# Altium schematic sheet Sheet1.SchDoc
size A4
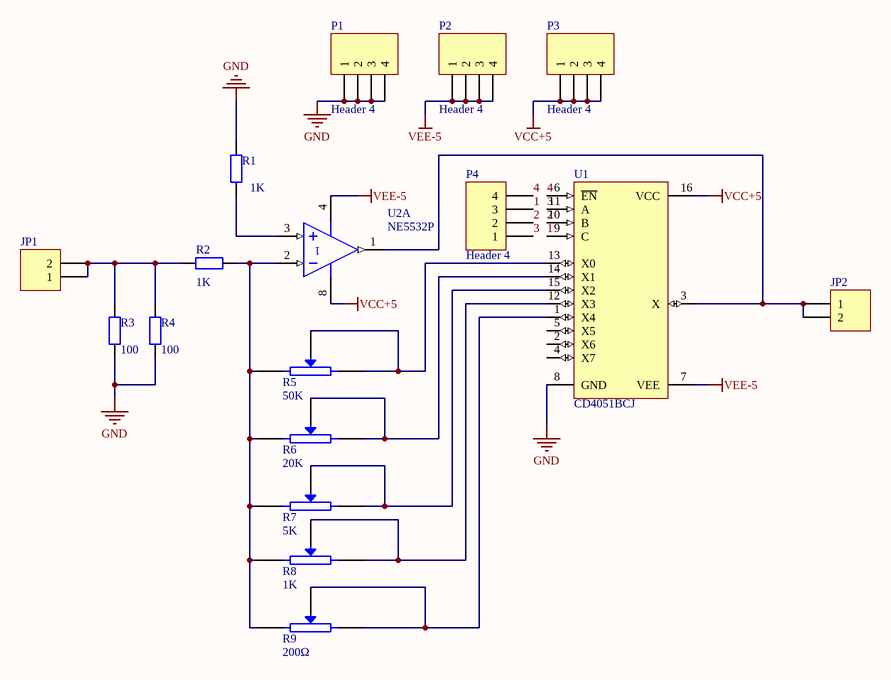
[diagram p0: Sheet1.SchDoc]

## Parts
JP1  Header 2  [HDR1X2]  (value not drawn)
JP2  Header 2  [HDR1X2]  (value not drawn)
P1  Header 4  [HDR1X4]
P2  Header 4  [HDR1X4]
P3  Header 4  [HDR1X4]
P4  Header 4  [HDR1X4]
R1  value 1K  [0805]  (hidden comment: Res2)
R2  value 1K  [0805]  (hidden comment: Res2)
R3  value 100  [0805]  (hidden comment: Res2)
R4  value 100  [0805]  (hidden comment: Res2)
R5  50K  [VR5]
R6  20K  [VR5]
R7  5K  [VR5]
R8  1K  [VR5]
R9  200Ω  [VR5]
U1  CD4051BCJ  [J16A]
U2  NE5532P  [P008]  (part A of 2)

## Nets
GND: P1.1 P1.2 P1.3 P1.4 R1.2 R3.1 R4.1 U1.8(GND)
VCC+5: P3.1 P3.2 P3.3 P3.4 U1.16(VCC) U2.8(V+)
VEE-5: P2.1 P2.2 P2.3 P2.4 U1.7(VEE) U2.4(V-)
1: P4.3 U1.9(C)
2: P4.2 U1.10(B)
3: P4.1 U1.11(A)
4: P4.4 U1.6(~{EN})
NetJP1_1: JP1.1 JP1.2 R2.1 R3.2 R4.2
NetJP2_1: JP2.1 JP2.2 U1.3(X) U2.1(OUT)
NetR1_1: R1.1 U2.3(IN+)
NetR2_2: R2.2 R5.1 R6.1 R7.1 R8.1 R9.1 U2.2(IN-)
NetR5_2: R5.2 R5.3(W) U1.13(X0)
NetR6_2: R6.2 R6.3(W) U1.14(X1)
NetR7_2: R7.2 R7.3(W) U1.15(X2)
NetR8_2: R8.2 R8.3(W) U1.12(X3)
NetR9_2: R9.2 R9.3(W) U1.1(X4)

Not connected (* = marked no-connect by the designer): U1 2(X6) 4(X7) 5(X5)

## Library data of the parts
JP1 JP2 = Header 2: Header, 2-Pin; Revision: 17-Jul-2002: Re-released for DXP Platform.; Publisher: Altium Limited
P1-P4 = Header 4: Header, 4-Pin; LatestRevisionDate: 17-Jul-2002; LatestRevisionNote: Re-released for DXP Platform.; Publisher: Altium Limited
R1-R4 = Res2: Resistor; Published: 8-Jun-2000; LatestRevisionDate: 17-Jul-2002; LatestRevisionNote: Re-released for DXP Platform.; PackageReference: AXIAL-0.4; Publisher: Altium Limited
R5-R9 = POT2: Potentiometer
U1 = CD4051BCJ: 8-Channel Analog Multiplexer/Demultiplexer; Published: 15-Apr-2002; LatestRevisionDate: 06-Jun-2005; LatestRevisionNote: Stylized 3D Model Added.; DatasheetVersion: Oct-1989; PackageVersion: 2000; PackageReference: J16A; Publisher: Altium Limited; PackageDescription: DIP; 16 Leads; Row Spacing 7.62 mm; Pitch 2.54 mm; ComponentLink1Description: Manufacturer Link; ComponentLink1URL: http://www.national.com/; ComponentLink2Description: Datasheet; ComponentLink2URL: http://www.national.com/ds.cgi/CD/CD4051BC.pdf; ComponentLink3Description: URL Link1; ComponentLink3URL: http://www.national.com/pf/CD/CD4051BC.html
U2 = NE5532P: Dual Low-Noise Operational Amplifier; Published: 15-Apr-2002; LatestRevisionDate: 04-Mar-2005; LatestRevisionNote: Stylized 3D Model Added.; DatasheetVersion: May-1988; PackageVersion: Jun-1999; PackageReference: P008; Publisher: Altium Limited; PackageDescription: DIP; 8 Leads; Row Spacing 7.62 mm; Pitch 2.54 mm; Code_JEDEC: MO-001-AN; ComponentLink1Description: Manufacturer Link; ComponentLink1URL: http://www.ti.com/; ComponentLink2Description: Datasheet; ComponentLink2URL: http://www-s.ti.com/sc/ds/ne5532a.pdf